# EAGLE design MAIN_TOP_P (EAGLE 9.4.2)
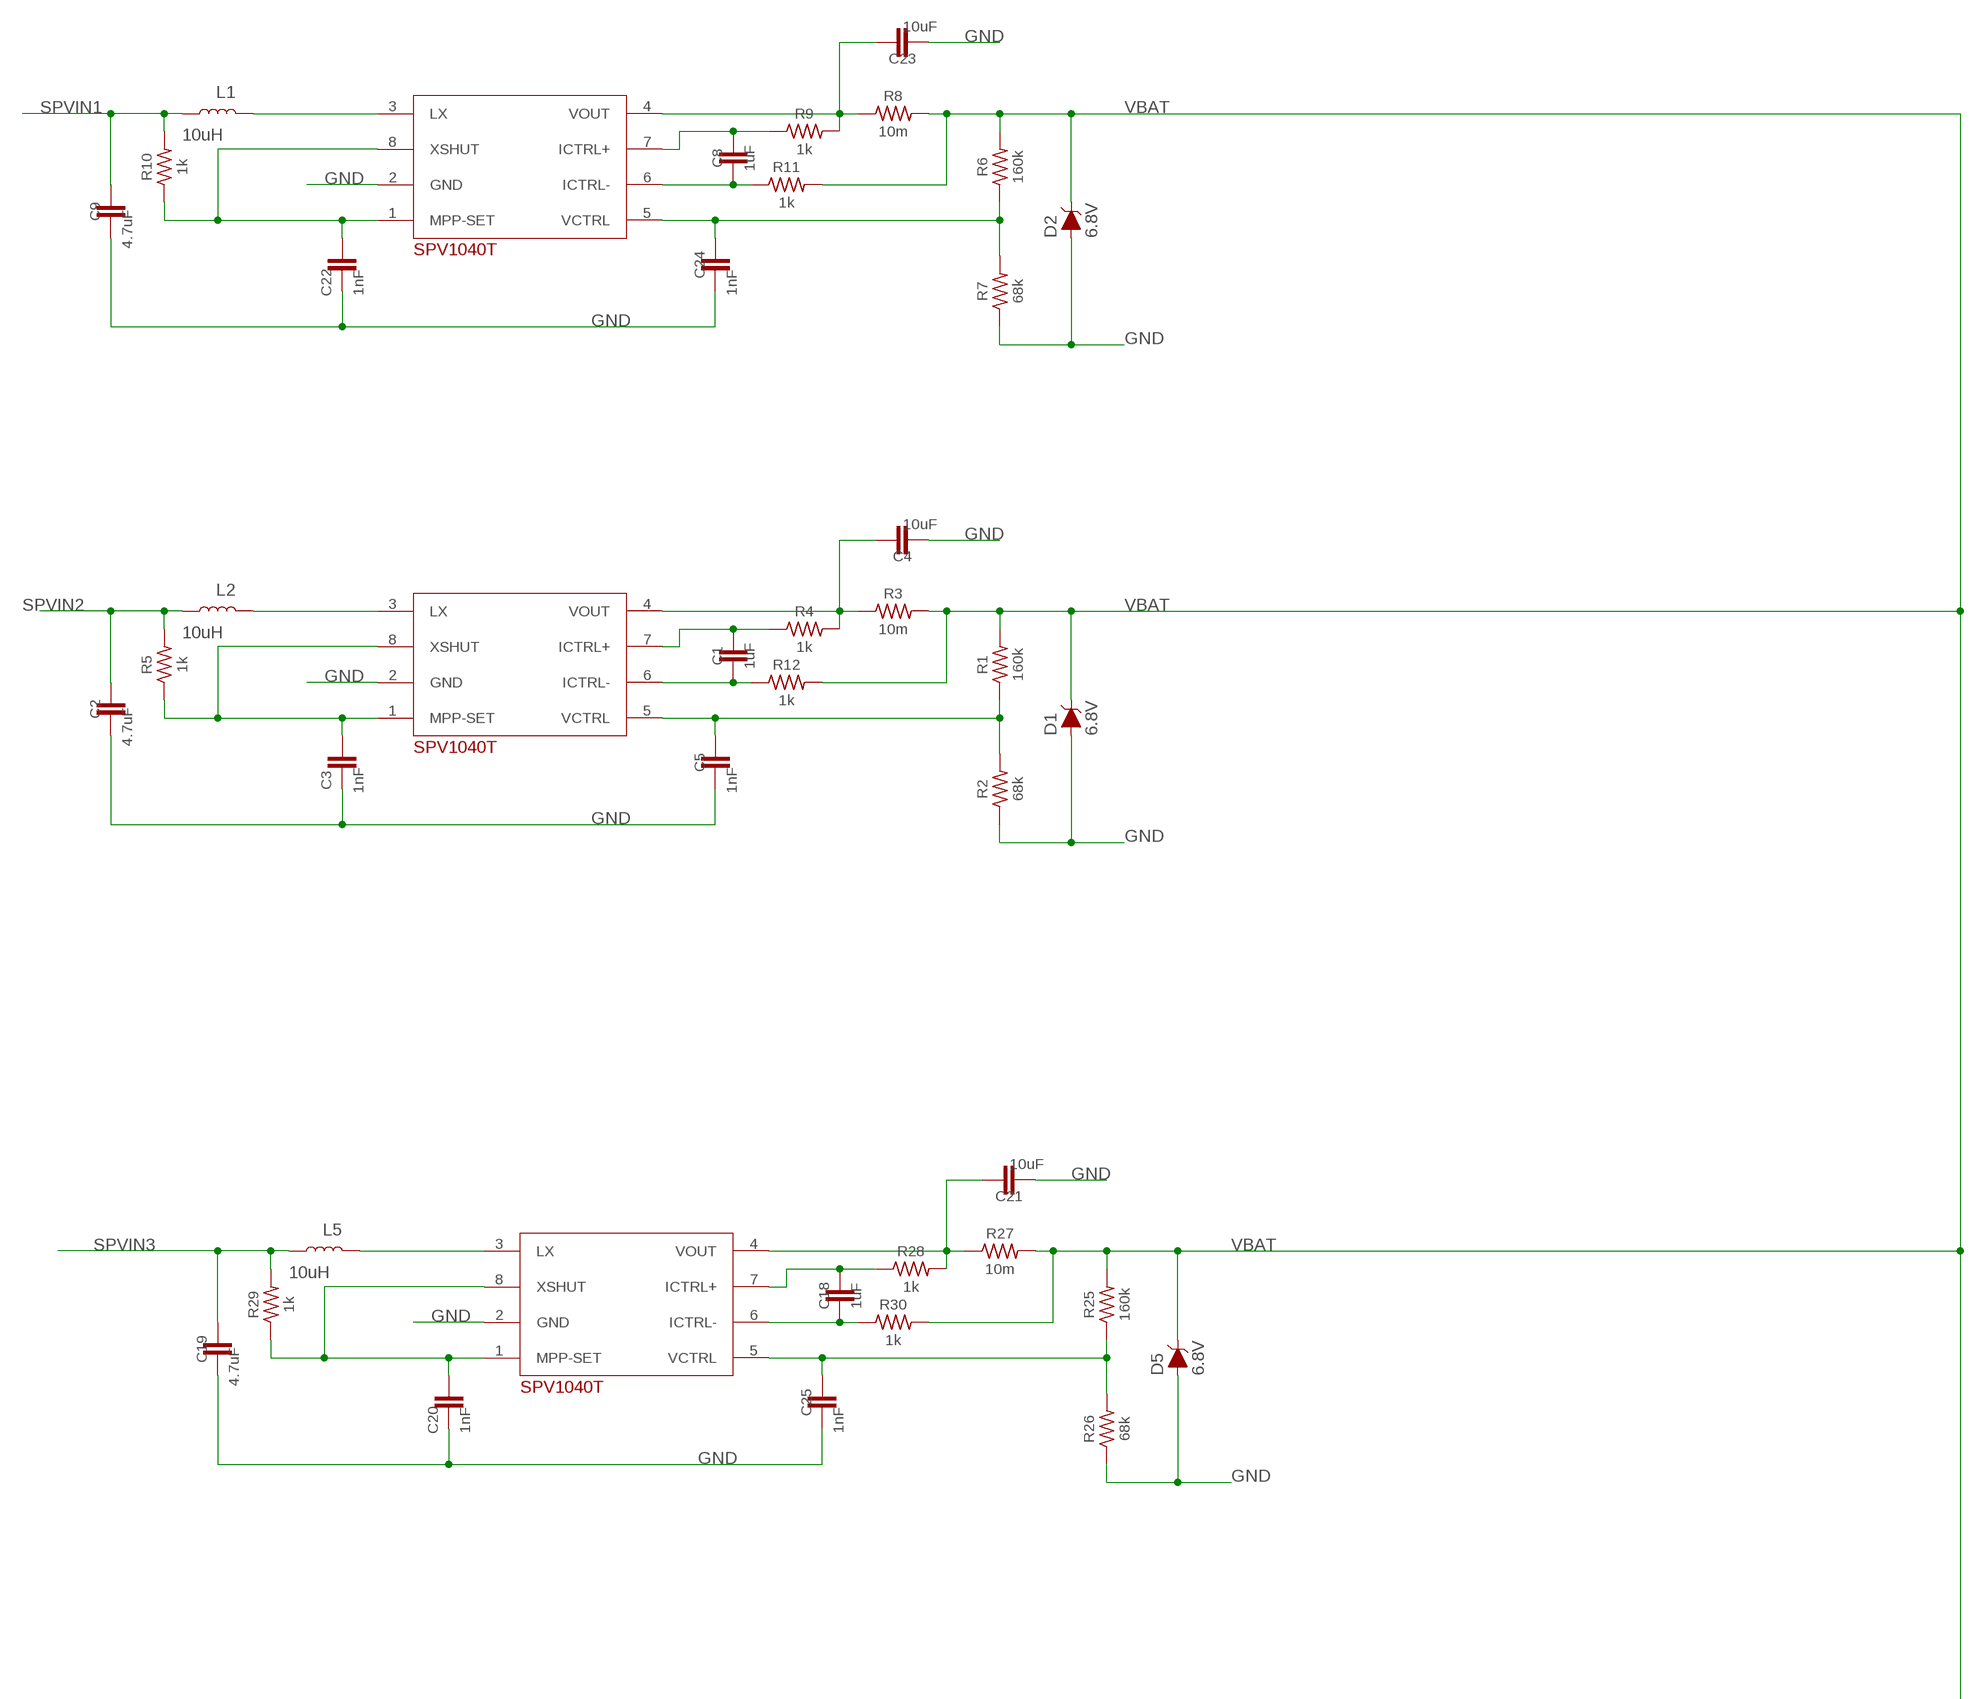
[diagram p0: schematic, sheet 1, part 1 of 3]
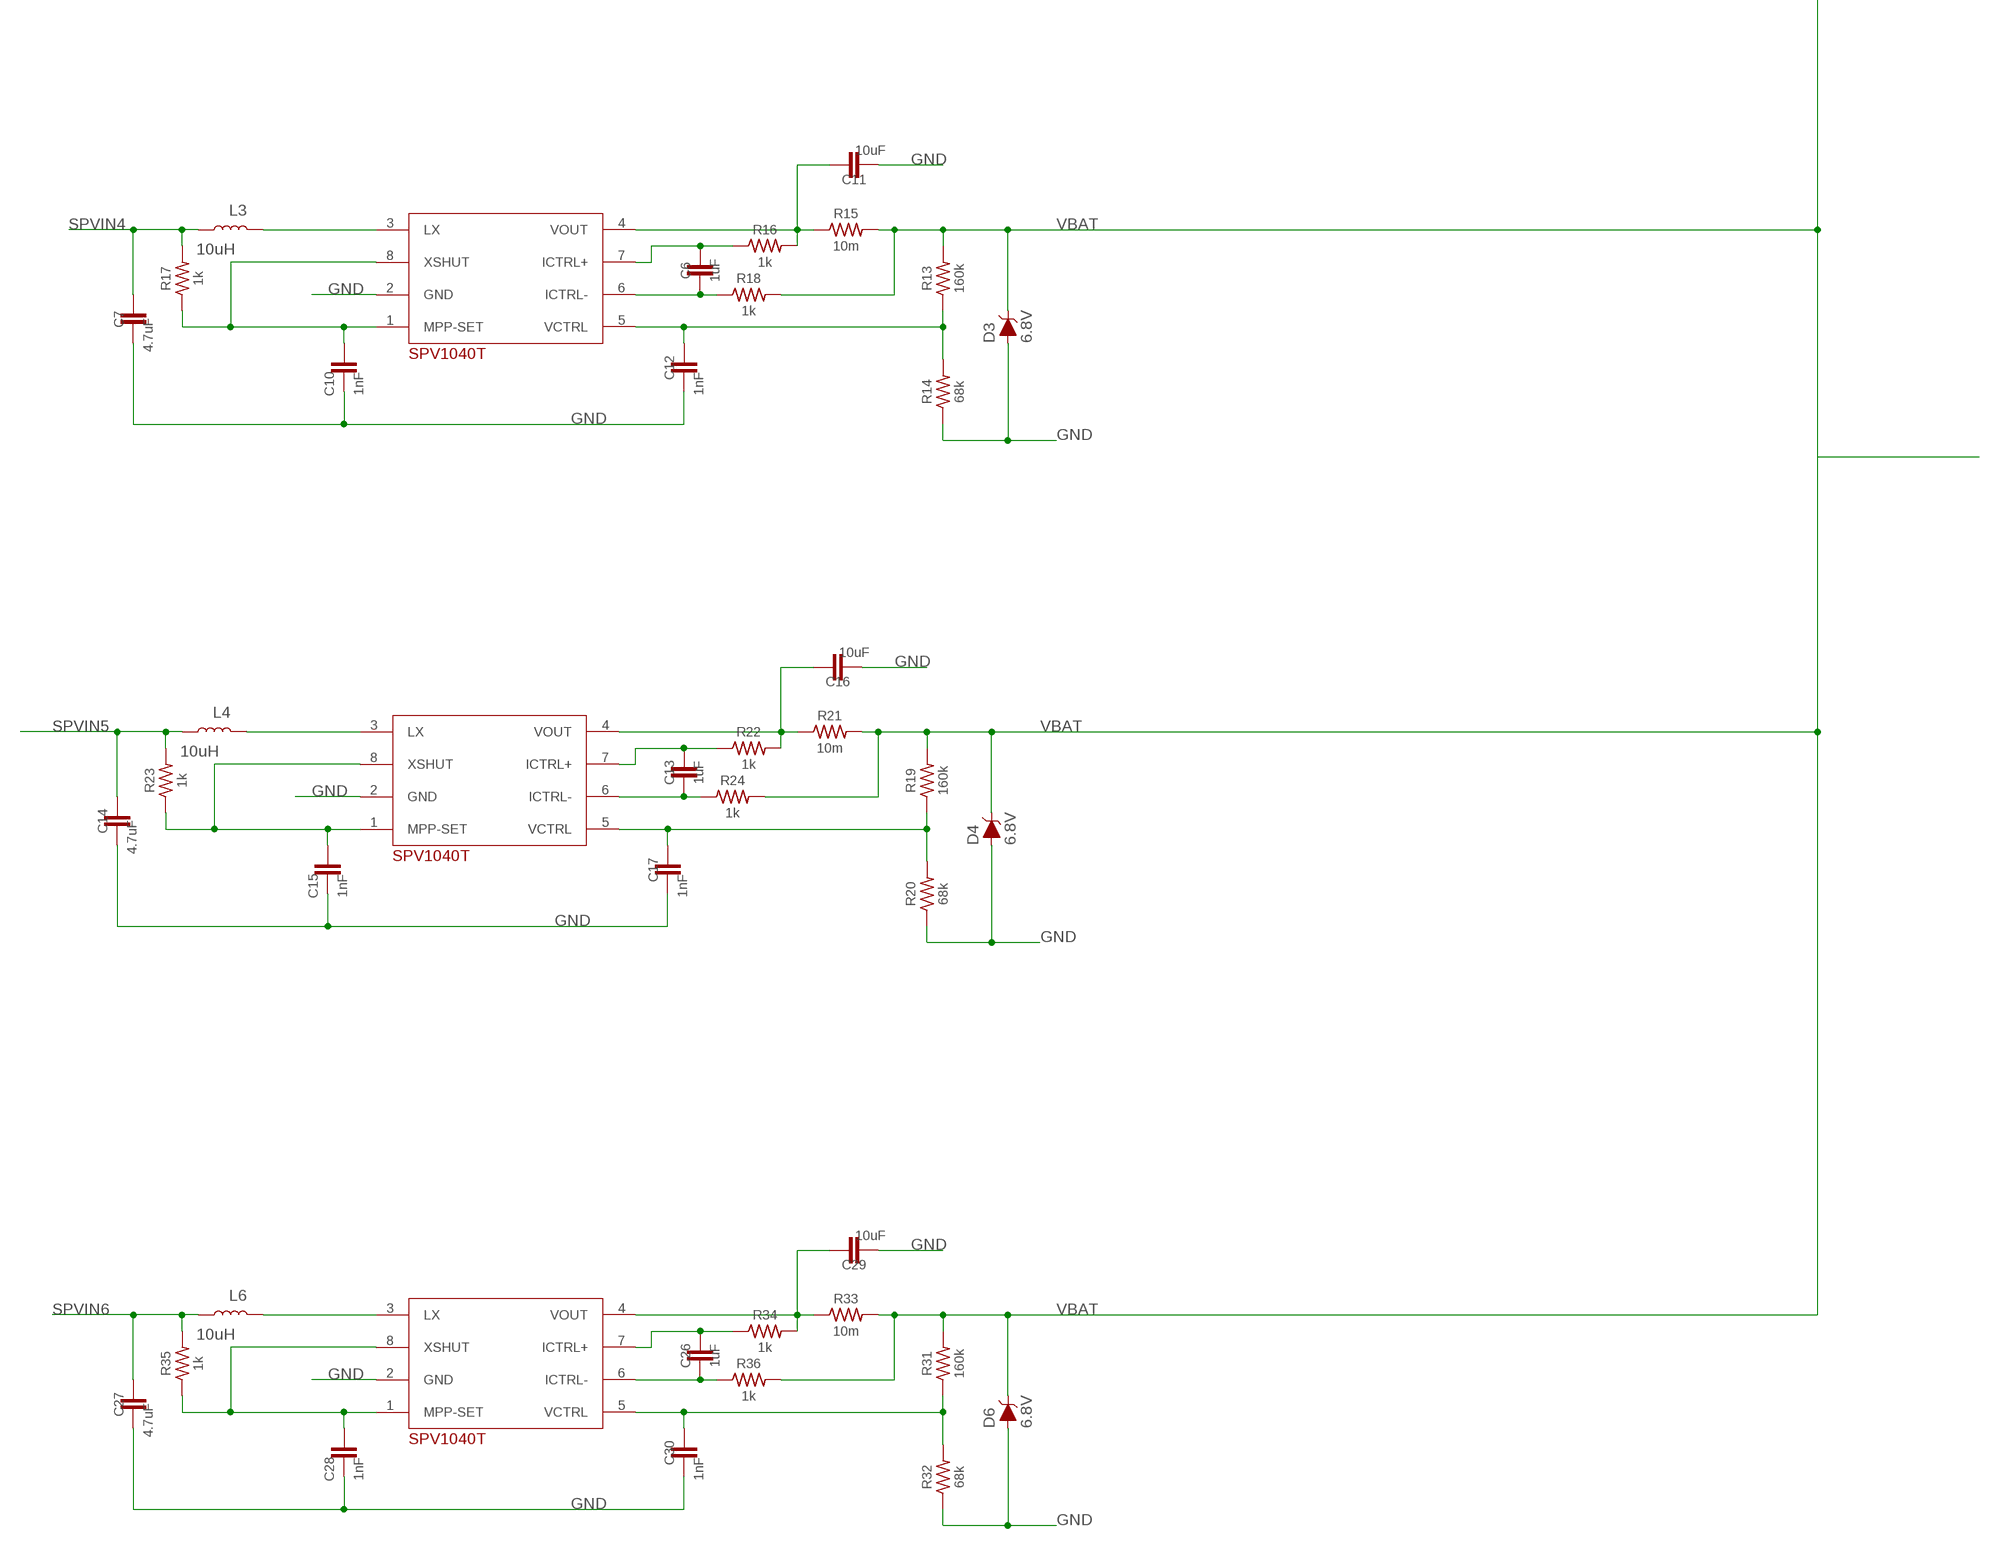
[diagram p1: schematic, sheet 1, part 2 of 3]
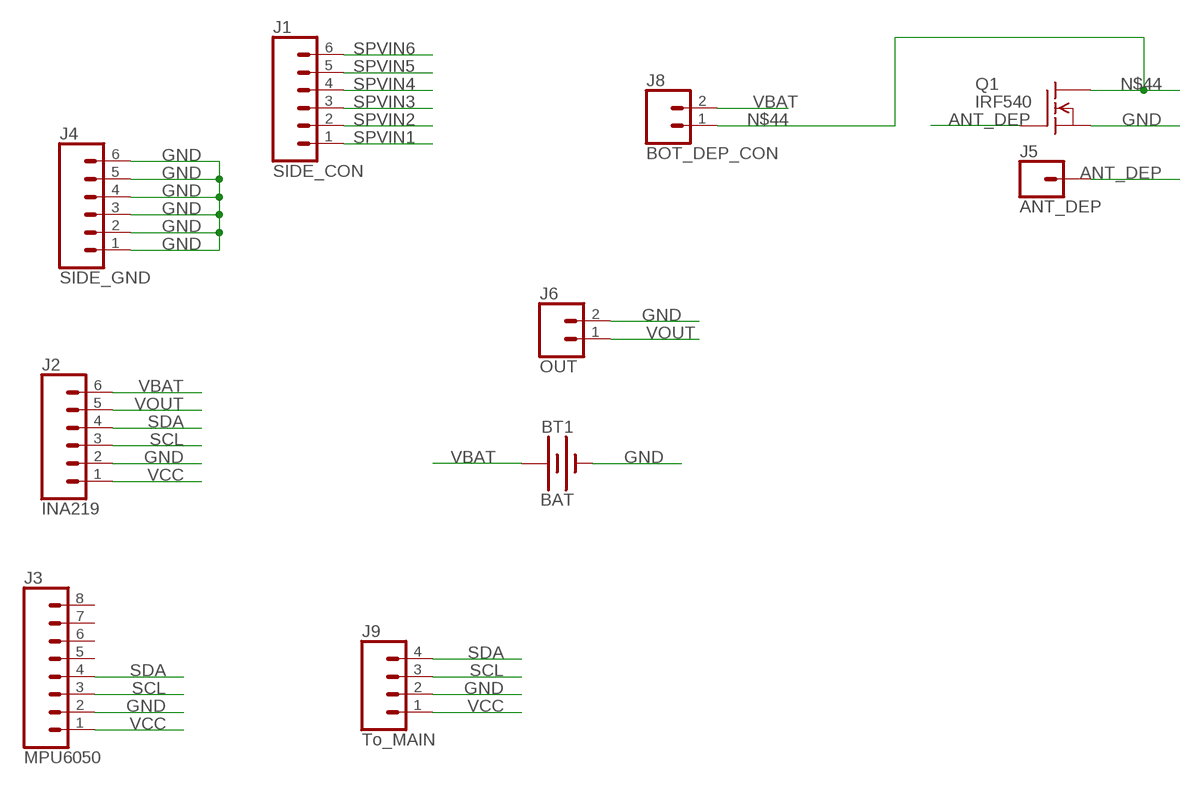
[diagram p2: schematic, sheet 1, part 3 of 3]

## Parts
BT1  BAT  BATTERY-18650  [BATTERY_18650-HOLDER]
C1  1uF  10UF-0603-6.3V-20%  [0603]
C2  4.7uF  10UF-0603-6.3V-20%  [0603]
C3  1nF  10UF-0603-6.3V-20%  [0603]
C4  10uF  10UF-0603-6.3V-20%  [0603]
C5  1nF  10UF-0603-6.3V-20%  [0603]
C6  1uF  10UF-0603-6.3V-20%  [0603]
C7  4.7uF  10UF-0603-6.3V-20%  [0603]
C8  1uF  10UF-0603-6.3V-20%  [0603]
C9  4.7uF  10UF-0603-6.3V-20%  [0603]
C10  1nF  10UF-0603-6.3V-20%  [0603]
C11  10uF  10UF-0603-6.3V-20%  [0603]
C12  1nF  10UF-0603-6.3V-20%  [0603]
C13  1uF  10UF-0603-6.3V-20%  [0603]
C14  4.7uF  10UF-0603-6.3V-20%  [0603]
C15  1nF  10UF-0603-6.3V-20%  [0603]
C16  10uF  10UF-0603-6.3V-20%  [0603]
C17  1nF  10UF-0603-6.3V-20%  [0603]
C18  1uF  10UF-0603-6.3V-20%  [0603]
C19  4.7uF  10UF-0603-6.3V-20%  [0603]
C20  1nF  10UF-0603-6.3V-20%  [0603]
C21  10uF  10UF-0603-6.3V-20%  [0603]
C22  1nF  10UF-0603-6.3V-20%  [0603]
C23  10uF  10UF-0603-6.3V-20%  [0603]
C24  1nF  10UF-0603-6.3V-20%  [0603]
C25  1nF  10UF-0603-6.3V-20%  [0603]
C26  1uF  10UF-0603-6.3V-20%  [0603]
C27  4.7uF  10UF-0603-6.3V-20%  [0603]
C28  1nF  10UF-0603-6.3V-20%  [0603]
C29  10uF  10UF-0603-6.3V-20%  [0603]
C30  1nF  10UF-0603-6.3V-20%  [0603]
D1  6.8V  DIODE-ZENER-MMSZ5232BS  [SOD-323]
D2  6.8V  DIODE-ZENER-MMSZ5232BS  [SOD-323]
D3  6.8V  DIODE-ZENER-MMSZ5232BS  [SOD-323]
D4  6.8V  DIODE-ZENER-MMSZ5232BS  [SOD-323]
D5  6.8V  DIODE-ZENER-MMSZ5232BS  [SOD-323]
D6  6.8V  DIODE-ZENER-MMSZ5232BS  [SOD-323]
J1  SIDE_CON  CONN_06SILK_FEMALE_PTH  [1X06]
J2  INA219  CONN_06SILK_FEMALE_PTH  [1X06]
J3  MPU6050  CONN_08"  [1X08]
J4  SIDE_GND  CONN_06SILK_FEMALE_PTH  [1X06]
J5  ANT_DEP  CONN_01  [1X01]
J6  OUT  CONN_02  [1X02]
J8  BOT_DEP_CON  CONN_02  [1X02]
J9  To_MAIN  CONN_04PTH  [1X04]
L1  10uH  INDUCTOR-0603-33NH  [0603]
L2  10uH  INDUCTOR-0603-33NH  [0603]
L3  10uH  INDUCTOR-0603-33NH  [0603]
L4  10uH  INDUCTOR-0603-33NH  [0603]
L5  10uH  INDUCTOR-0603-33NH  [0603]
L6  10uH  INDUCTOR-0603-33NH  [0603]
Q1  IRF540  [TO220]
R1  160k  RC0603JR-070RL  [RES_0603]
R2  68k  RC0603JR-070RL  [RES_0603]
R3  10m  RC0603JR-070RL  [RES_0603]
R4  1k  RC0603JR-070RL  [RES_0603]
R5  1k  RC0603JR-070RL  [RES_0603]
R6  160k  RC0603JR-070RL  [RES_0603]
R7  68k  RC0603JR-070RL  [RES_0603]
R8  10m  RC0603JR-070RL  [RES_0603]
R9  1k  RC0603JR-070RL  [RES_0603]
R10  1k  RC0603JR-070RL  [RES_0603]
R11  1k  RC0603JR-070RL  [RES_0603]
R12  1k  RC0603JR-070RL  [RES_0603]
R13  160k  RC0603JR-070RL  [RES_0603]
R14  68k  RC0603JR-070RL  [RES_0603]
R15  10m  RC0603JR-070RL  [RES_0603]
R16  1k  RC0603JR-070RL  [RES_0603]
R17  1k  RC0603JR-070RL  [RES_0603]
R18  1k  RC0603JR-070RL  [RES_0603]
R19  160k  RC0603JR-070RL  [RES_0603]
R20  68k  RC0603JR-070RL  [RES_0603]
R21  10m  RC0603JR-070RL  [RES_0603]
R22  1k  RC0603JR-070RL  [RES_0603]
R23  1k  RC0603JR-070RL  [RES_0603]
R24  1k  RC0603JR-070RL  [RES_0603]
R25  160k  RC0603JR-070RL  [RES_0603]
R26  68k  RC0603JR-070RL  [RES_0603]
R27  10m  RC0603JR-070RL  [RES_0603]
R28  1k  RC0603JR-070RL  [RES_0603]
R29  1k  RC0603JR-070RL  [RES_0603]
R30  1k  RC0603JR-070RL  [RES_0603]
R31  160k  RC0603JR-070RL  [RES_0603]
R32  68k  RC0603JR-070RL  [RES_0603]
R33  10m  RC0603JR-070RL  [RES_0603]
R34  1k  RC0603JR-070RL  [RES_0603]
R35  1k  RC0603JR-070RL  [RES_0603]
R36  1k  RC0603JR-070RL  [RES_0603]
SPV_1  SPV1040T_  [SOP65P640X120-8N]
SPV_2  SPV1040T_  [SOP65P640X120-8N]
SPV_3  SPV1040T_  [SOP65P640X120-8N]
SPV_4  SPV1040T_  [SOP65P640X120-8N]
SPV_5  SPV1040T_  [SOP65P640X120-8N]
SPV_6  SPV1040T_  [SOP65P640X120-8N]

## Nets
ANT_DEP: J5.1 Q1.1(G)
GND [vcc]: BT1.GND@1(-) C2.2 C3.2 C4.2 C5.2 C7.2 C9.2 C10.2 C11.2 C12.2 C14.2 C15.2 C16.2 C17.2 C19.2 C20.2 C21.2 C22.2 C23.2 C24.2 C25.2 C27.2 C28.2 C29.2 C30.2 D1.A D2.A D3.A D4.A D5.A D6.A J2.2 J3.2 J4.1 J4.2 J4.3 J4.4 J4.5 J4.6 J6.2 J9.2 Q1.3(S) R2.1 R7.1 R14.1 R20.1 R26.1 R32.1 SPV_1.2(GND) SPV_2.2(GND) SPV_3.2(GND) SPV_4.2(GND) SPV_5.2(GND) SPV_6.2(GND)
N$1: L2.2 SPV_2.3(LX)
N$2: C3.1 R5.1 SPV_2.1(MPP-SET) SPV_2.8(XSHUT)
N$3: C5.1 R1.1 R2.2 SPV_2.5(VCTRL)
N$4: C1.2 R12.1 SPV_2.6(ICTRL-)
N$5: L1.2 SPV_1.3(LX)
N$6: C1.1 R4.1 SPV_2.7(ICTRL+)
N$7: C4.1 R3.1 R4.2 SPV_2.4(VOUT)
N$8: L3.2 SPV_4.3(LX)
N$9: C10.1 R17.1 SPV_4.1(MPP-SET) SPV_4.8(XSHUT)
N$10: C12.1 R13.1 R14.2 SPV_4.5(VCTRL)
N$11: C6.2 R18.1 SPV_4.6(ICTRL-)
N$12: C6.1 R16.1 SPV_4.7(ICTRL+)
N$13: C11.1 R15.1 R16.2 SPV_4.4(VOUT)
N$14: L4.2 SPV_5.3(LX)
N$15: C15.1 R23.1 SPV_5.1(MPP-SET) SPV_5.8(XSHUT)
N$16: C17.1 R19.1 R20.2 SPV_5.5(VCTRL)
N$17: C13.2 R24.1 SPV_5.6(ICTRL-)
N$18: C13.1 R22.1 SPV_5.7(ICTRL+)
N$19: C16.1 R21.1 R22.2 SPV_5.4(VOUT)
N$20: L5.2 SPV_3.3(LX)
N$21: C20.1 R29.1 SPV_3.1(MPP-SET) SPV_3.8(XSHUT)
N$22: C25.1 R25.1 R26.2 SPV_3.5(VCTRL)
N$23: C18.2 R30.1 SPV_3.6(ICTRL-)
N$24: C18.1 R28.1 SPV_3.7(ICTRL+)
N$25: C21.1 R27.1 R28.2 SPV_3.4(VOUT)
N$26: L6.2 SPV_6.3(LX)
N$27: C28.1 R35.1 SPV_6.1(MPP-SET) SPV_6.8(XSHUT)
N$28: C30.1 R31.1 R32.2 SPV_6.5(VCTRL)
N$29: C26.2 R36.1 SPV_6.6(ICTRL-)
N$30: C26.1 R34.1 SPV_6.7(ICTRL+)
N$31: C22.1 R10.1 SPV_1.1(MPP-SET) SPV_1.8(XSHUT)
N$32: C24.1 R6.1 R7.2 SPV_1.5(VCTRL)
N$33: C29.1 R33.1 R34.2 SPV_6.4(VOUT)
N$34: C8.2 R11.1 SPV_1.6(ICTRL-)
N$35: C8.1 R9.1 SPV_1.7(ICTRL+)
N$36: C23.1 R8.1 R9.2 SPV_1.4(VOUT)
N$44: J8.1 Q1.2(D)
SCL: J2.3 J3.3 J9.3
SDA: J2.4 J3.4 J9.4
SPVIN1: C9.1 J1.1 L1.1 R10.2
SPVIN2: C2.1 J1.2 L2.1 R5.2
SPVIN3: C19.1 J1.3 L5.1 R29.2
SPVIN4: C7.1 J1.4 L3.1 R17.2
SPVIN5: C14.1 J1.5 L4.1 R23.2
SPVIN6: C27.1 J1.6 L6.1 R35.2
VBAT: BT1.PWR@1(+) D1.C D2.C D3.C D4.C D5.C D6.C J2.6 J8.2 R1.2 R3.2 R6.2 R8.2 R11.2 R12.2 R13.2 R15.2 R18.2 R19.2 R21.2 R24.2 R25.2 R27.2 R30.2 R31.2 R33.2 R36.2
VCC: J2.1 J3.1 J9.1
VOUT: J2.5 J6.1
Unconnected: J3.5 J3.6 J3.7 J3.8

## Library data of the parts
BT1 = SparkFun-Batteries:BATTERY: Battery - Single Cell A variety of battery chemistries, sizes, and footprints. Device List: 20MM_PTH - Coin Cell Battery Holder - 20mm (PTH) <https://www.sparkfun.com/products/783> 20MM_PTH_KIT- Coin Cell battery Holder - 20 mm (PTH) <http://www.sparkfun.com/products/783>kit version with special mask 6.8MM_PTH - Coin Cell Battery Holder - 6.8MM(SMD) <https://www.digikey.com/product-detail/en/seiko-instruments/MS621FE-FL11E/728-1057-ND/1889208?WT.srch=1&gclid=CNOQ5a6LzdQCFZS2wAodXCkE0g> 12MM_SMD - Coin Cell Battery Holder - 12mm (SMD) <https://www.sparkfun.com/products/10592> 12MM_PTH - Coin Cell Battery Holder - 12mm (PTH) <https://www.sparkfun.com/products/7948> 20MM_SMD - 20mm Coin Cell Battery Holder (SMD) (2 legs) Used on the Big Time Watch Kit <https://www.sparkfun.com/products/11734> 20MM_SMD_4LEGS - Coin Cell Battery Holder - 20mm (SMD) <https://www.sparkfun.com/products/11892> 20MM_SMD_4LEGS_OVERPASTE - Coin Cell Battery Holder - 20mm (SMD) <https://www.sparkfun.com/products/11892> (Over-paste on the legs) 24.5MM_PTH - Coin Cell Battery Holder - 24.5mm (PTH) <https://www.sparkfun.com/products/8863> 9V - 9V Battery Holder - PC Mount Used on the SparkFun SparkPunk Sound Kit <https://www.sparkfun.com/products/11177> and SparkFun SparkPunk Sequencer Kit <https://www.sparkfun.com/products/12707> 18650 - Battery Holder - 18650 (PTH) <https://www.sparkfun.com/products/13113> AA - Battery Holder - 1xAA (PTH) <https://www.sparkfun.com/products/7949> AAA - Battery Holder - 1xAAA (PTH) <https://www.sparkfun.com/products/12718> AA_KIT - Battery Holder - 1xAA (PTH) <https://www.sparkfun.com/products/7949> Special kit package - pads only have exposed copper on one side of the board. AAA_KIT - Battery Holder - 1xAAA (PTH) <https://www.sparkfun.com/products/12718> Special kit package - pads only have exposed copper on one side of the board.; PROD_ID: BATT-12327; SF_SKU: PRT-13113
C1-C3 C5-C10 C12-C15 C17-C20 C22 C24-C28 C30 = SparkFun-Capacitors:10UF: 10.0µF ceramic capacitors A capacitor is a passive two-terminal electrical component used to store electrical energy temporarily in an electric field.; PROD_ID: CAP-11015; VALUE: 10uF
C4 C11 C16 C21 C23 C29 = SparkFun-Capacitors:10UF: 10.0µF ceramic capacitors A capacitor is a passive two-terminal electrical component used to store electrical energy temporarily in an electric field.; PROD_ID: CAP-11015
D1-D6 = SparkFun-DiscreteSemi:DIODE-ZENER: Zener Diode A Zener diode allows current to flow from its anode to its cathode like a normal semiconductor diode, but it also permits current to flow in the reverse direction when its "Zener voltage" is reached. - WIkipedia; PROD_ID: DIO-12442; VALUE: 5.6V
J1 J2 J4 = SparkFun-Connectors:CONN_06: Multi connection point. Often used as Generic Header-pin footprint for 0.1 inch spaced/style header connections On any of the 0.1 inch spaced packages, you can populate with these: Break Away Headers - Straight <https://www.sparkfun.com/products/116> (PRT-00116) Break Away Male Headers - Right Angle <https://www.sparkfun.com/products/553> (PRT-00553) Female Headers <https://www.sparkfun.com/products/115> (PRT-00115) Break Away Headers - Machine Pin <https://www.sparkfun.com/products/117> (PRT-00117) Break Away Female Headers - Swiss Machine Pin <https://www.sparkfun.com/products/743> (PRT-00743) Arduino Stackable Header - 6 Pin <https://www.sparkfun.com/products/9280> (PRT-09280) For SCREWTERMINALS and SPRING TERMINALS visit here: Screw Terimnals on SparkFun.com <https://www.sparkfun.com/search/results?term=Screw+Terminals> (5mm/3.5mm/2.54mm spacing) This device is also useful as a general connection point to wire up your design to another part of your project. Our various solder wires solder well into these plated through hole pads. Hook-Up Wire - Assortment (Stranded, 22 AWG) <https://www.sparkfun.com/products/11375> (PRT-11375) Hook-Up Wire - Assortment (Solid Core, 22 AWG) <https://www.sparkfun.com/products/11367> (PRT-11367) View the entire wire category on our website here <https://www.sparkfun.com/categories/141>; PROD_ID: CONN-08437
J3 = SparkFun-Connectors:CONN_08: Multi connection point. Often used as Generic Header-pin footprint for 0.1 inch spaced/style header connections On any of the 0.1 inch spaced packages, you can populate with these: Break Away Headers - Straight <https://www.sparkfun.com/products/116> (PRT-00116) Break Away Male Headers - Right Angle <https://www.sparkfun.com/products/553> (PRT-00553) Female Headers <https://www.sparkfun.com/products/115> (PRT-00115) Break Away Headers - Machine Pin <https://www.sparkfun.com/products/117> (PRT-00117) Break Away Female Headers - Swiss Machine Pin <https://www.sparkfun.com/products/743> (PRT-00743) Arduino Stackable Header - 8 Pin <https://www.sparkfun.com/products/9279> (PRT-09279) For SCREWTERMINALS and SPRING TERMINALS visit here: Screw Terimnals on SparkFun.com <https://www.sparkfun.com/search/results?term=Screw+Terminals> (5mm/3.5mm/2.54mm spacing) This device is also useful as a general connection point to wire up your design to another part of your project. Our various solder wires solder well into these plated through hole pads. Hook-Up Wire - Assortment (Stranded, 22 AWG) <https://www.sparkfun.com/products/11375> (PRT-11375) Hook-Up Wire - Assortment (Solid Core, 22 AWG) <https://www.sparkfun.com/products/11367> (PRT-11367) View the entire wire category on our website here <https://www.sparkfun.com/categories/141> Special notes: Molex polarized connector foot print use with SKU : PRT-08231 with associated crimp pins and housings. 1MM SMD Version SKU: PRT-10208 NOTES ON THE VARIANTS LOCK and LOCK_LONGPADS... This footprint was designed to help hold the alignment of a through-hole component (i.e. 6-pin header) while soldering it into place. You may notice that each hole has been shifted either up or down by 0.005 of an inch from it's more standard position (which is a perfectly straight line). This slight alteration caused the pins (the squares in the middle) to touch the edges of the holes. Because they are alternating, it causes a "brace" to hold the component in place. 0.005 has proven to be the perfect amount of "off-center" position when using our standard breakaway headers. Although looks a little odd when you look at the bare footprint, once you have a header in there, the alteration is very hard to notice. Also,if you push a header all the way into place, it is covered up entirely on the bottom side.; PROD_ID: CONN-08438
J5 = SparkFun-Connectors:CONN_01: Single connection point. Often used as Generic Header-pin footprint for 0.1 inch spaced/style header connections On any of the 0.1 inch spaced packages, you can populate with these: Break Away Headers - Straight <https://www.sparkfun.com/products/116> (PRT-00116) Break Away Male Headers - Right Angle <https://www.sparkfun.com/products/553> (PRT-00553) Female Headers <https://www.sparkfun.com/products/115> (PRT-00115) Break Away Headers - Machine Pin <https://www.sparkfun.com/products/117> (PRT-00117) Break Away Female Headers - Swiss Machine Pin <https://www.sparkfun.com/products/743> (PRT-00743) This device is also useful as a general connection point to wire up your design to another part of your project. Our various solder wires solder well into these plated through hole pads. Hook-Up Wire - Assortment (Stranded, 22 AWG) <https://www.sparkfun.com/products/11375> (PRT-11375) Hook-Up Wire - Assortment (Solid Core, 22 AWG) <https://www.sparkfun.com/products/11367> (PRT-11367) View the entire wire category on our website here <https://www.sparkfun.com/categories/141> Special notes: SMTSO-256-ET is a "flush mount" nut for a 4-40 screw. We mostly use this on specialty testbeds; it is a nice way to connect hardware to your PCB at an adjustable hieght. Also note, the SNAP packages are for using a snappable style connector. We sell a baggie of snaps and they are also used on two LilyPad designs: Snap Assortment - 30 pack (male and female) <https://www.sparkfun.com/products/11347> (DEV-11347) LilyPad Arduino SimpleSnap <https://www.sparkfun.com/products/10941> (DEV-10941) LilyPad SimpleSnap Protoboard <https://www.sparkfun.com/products/10940> (DEV-10940)
J6 J8 = SparkFun-Connectors:CONN_02: Multi connection point. Often used as Generic Header-pin footprint for 0.1 inch spaced/style header connections On any of the 0.1 inch spaced packages, you can populate with these: Break Away Headers - Straight <https://www.sparkfun.com/products/116> (PRT-00116) Break Away Male Headers - Right Angle <https://www.sparkfun.com/products/553> (PRT-00553) Female Headers <https://www.sparkfun.com/products/115> (PRT-00115) Break Away Headers - Machine Pin <https://www.sparkfun.com/products/117> (PRT-00117) Break Away Female Headers - Swiss Machine Pin <https://www.sparkfun.com/products/743> (PRT-00743) For SCREWTERMINALS and SPRING TERMINALS visit here: Screw Terimnals on SparkFun.com <https://www.sparkfun.com/search/results?term=Screw+Terminals> (5mm/3.5mm/2.54mm spacing) This device is also useful as a general connection point to wire up your design to another part of your project. Our various solder wires solder well into these plated through hole pads. Hook-Up Wire - Assortment (Stranded, 22 AWG) <https://www.sparkfun.com/products/11375> (PRT-11375) Hook-Up Wire - Assortment (Solid Core, 22 AWG) <https://www.sparkfun.com/products/11367> (PRT-11367) View the entire wire category on our website here <https://www.sparkfun.com/categories/141> Special notes: Molex polarized connector foot print use with: PRT-08233 with associated crimp pins and housings. 2.54_SCREWTERM for use with PRT-10571. 3.5mm Screw Terminal footprints for PRT-08084 5mm Screw Terminal footprints for use with PRT-08432
J9 = SparkFun-Connectors:CONN_04: Multi connection point. Often used as Generic Header-pin footprint for 0.1 inch spaced/style header connections On any of the 0.1 inch spaced packages, you can populate with these: Break Away Headers - Straight <https://www.sparkfun.com/products/116> (PRT-00116) Break Away Male Headers - Right Angle <https://www.sparkfun.com/products/553> (PRT-00553) Female Headers <https://www.sparkfun.com/products/115> (PRT-00115) Break Away Headers - Machine Pin <https://www.sparkfun.com/products/117> (PRT-00117) Break Away Female Headers - Swiss Machine Pin <https://www.sparkfun.com/products/743> (PRT-00743) For SCREWTERMINALS and SPRING TERMINALS visit here: Screw Terimnals on SparkFun.com <https://www.sparkfun.com/search/results?term=Screw+Terminals> (5mm/3.5mm/2.54mm spacing) This device is also useful as a general connection point to wire up your design to another part of your project. Our various solder wires solder well into these plated through hole pads. Hook-Up Wire - Assortment (Stranded, 22 AWG) <https://www.sparkfun.com/products/11375> (PRT-11375) Hook-Up Wire - Assortment (Solid Core, 22 AWG) <https://www.sparkfun.com/products/11367> (PRT-11367) View the entire wire category on our website here <https://www.sparkfun.com/categories/141> Special notes: Molex polarized connector foot print use with SKU : PRT-08231 with associated crimp pins and housings. 1MM SMD Version SKU: PRT-10208; PROD_ID: CONN-09696
L1-L6 = SparkFun-Coils:INDUCTOR: Inductors Resist changes in electrical current. Basically a coil of wire. SparkFun Products: SparkFun Load Cell Amplifier - HX711 <https://www.sparkfun.com/products/13879> IOIO-OTG - V2.2 <https://www.sparkfun.com/products/13613>; PROD_ID: NDUC-07874; VALUE: 33nH/±5%/500mA
Q1 = transistor-fet:IRF540: N-Channel Enhancement MOSFET (HEXFET); 100V; 28A; 0,077Ohm
R1-R36 = Resistor_Capacitor:RC0603JR-070RL: RES SMD 0 OHM JUMPER 1/10W 0603 Manufacturer's datasheet <http://www.yageo.com/documents/recent/PYu-RC_Group_51_RoHS_L_10.pdf>; CREATED_BY: PCBLayout.com; DIGIKEY_PART_NUMBER: 311-0.0GRTR-ND; MANUFACTURER: Yageo; MPN: RC0603JR-070RL; PACKAGE: SMD 0603
SPV_1-SPV_6 = SPV1040T:SPV1040T_

## Net classes
1 vcc: width 0.254 mm

## Board
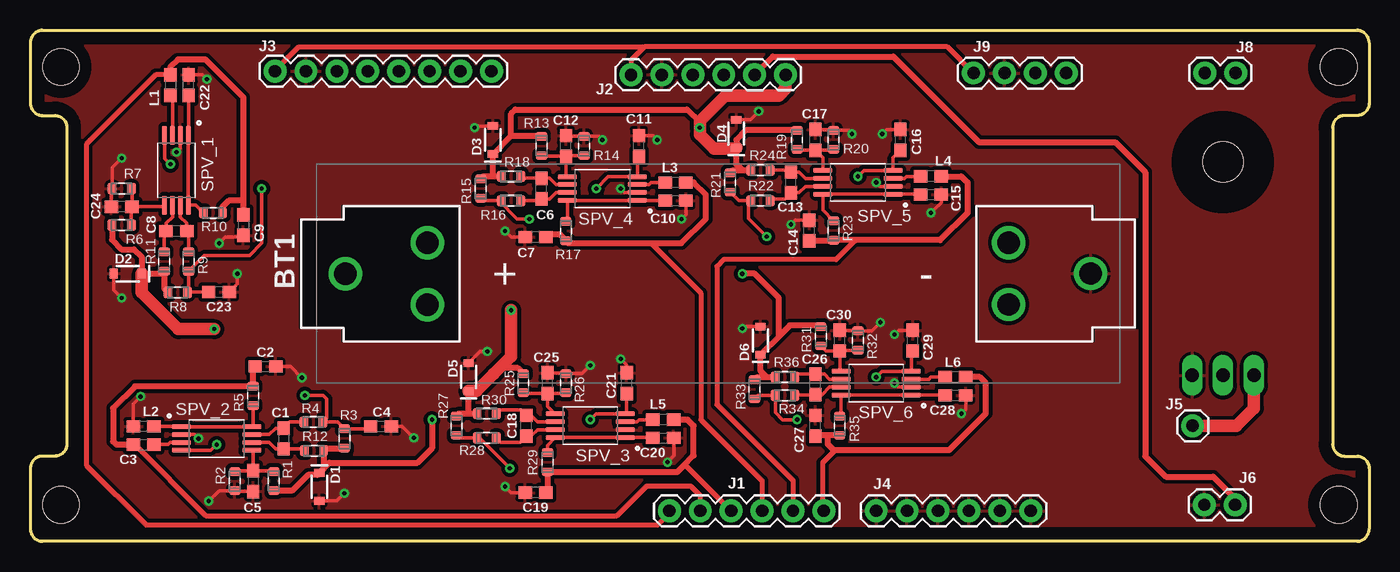
[diagram p3: board, top side]
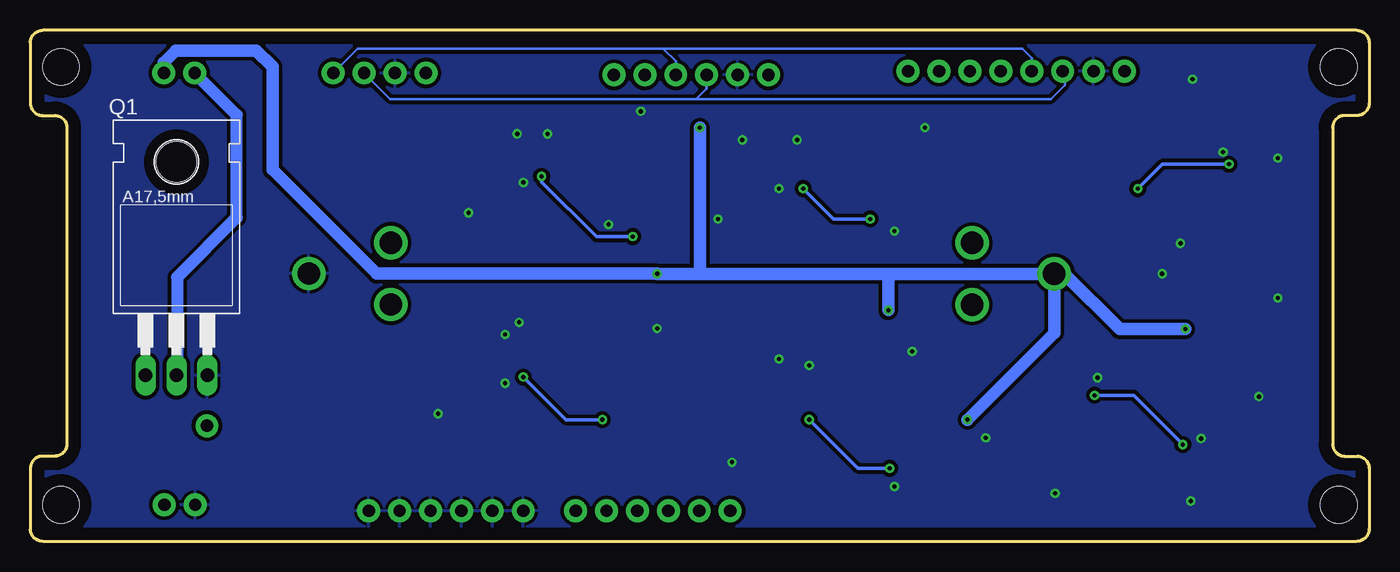
[diagram p4: board, bottom side, seen from below]

Size 110 x 42 mm. Coordinates in mm from the lower left corner, seen from the top.
Outline: 109,0 arc90 110,1 110,6 arc90 109,7 108,7 arc-90 107,8 107,34 arc-90 108,35 109,35 arc90 110,36 110,41 arc90 109,42 1,42 arc90 0,41 0,36 arc90 1,35 2,35 arc-90 3,34 3,8 arc-90 2,7 1,7 arc90 0,6 0,1 arc90 1,0 109,0
Copper layers (1*16): Top 0.035mm / dielectric 0.2mm / Bottom 0.035mm
Design rules "default *": minimum track width 6mil, minimum drill 0.35mm, track to track 12mil, track to pad 6mil, pad to pad 6mil, via to via 6mil, smd to smd 6mil, copper to edge 40mil, drill to drill 6mil, minimum pad ring 10mil, minimum via ring 8mil, stop-mask expansion 4mil, vias tented up to drill 0mil, thermal gap 10mil
Holes 3 mm at 2.5,39 2.5,3 107.5,3 107.5,39

### Footprints (pad centres in the part's own frame; a part is rotated, then mirrored left to right if it is on the bottom)
BATTERY_18650-HOLDER = drill 1.829: GND@1 30.628,0.01; GND@2 23.88,2.55; GND@3 23.88,-2.53; PWR@1 -30.628,-0.01; PWR@2 -23.88,2.53; PWR@3 -23.88,-2.55
0603 = smd 1.1 x 1: 1 -0.85,0; 2 0.85,0
SOD-323 = smd 0.63 x 0.83: A 1.15,0; C -1.15,0
1X06 = drill 1.016 pad 1.88: 1 0,0; 2 2.54,0; 3 5.08,0; 4 7.62,0; 5 10.16,0; 6 12.7,0
1X08 = drill 1.016 pad 1.88: 1 0,0; 2 2.54,0; 3 5.08,0; 4 7.62,0; 5 10.16,0; 6 12.7,0; 7 15.24,0; 8 17.78,0
1X01 = drill 1.016 pad 1.88: 1 0,0
1X02 = drill 1.016 pad 1.88: 1 0,0; 2 2.54,0
1X04 = drill 1.016 pad 1.88: 1 0,0; 2 2.54,0; 3 5.08,0; 4 7.62,0
TO220 = drill 1.118 long: 1 -2.54,-6.35; 2 0,-6.35; 3 2.54,-6.35 | hole 3.302: 0,11.176
RES_0603 = smd 0.74 x 0.93: 1 -0.795,0; 2 0.795,0
SOP65P640X120-8N = smd 1.56 x 0.41: 1 -2.88,0.975; 2 -2.88,0.325; 3 -2.88,-0.325; 4 -2.88,-0.975; 5 2.88,-0.975; 6 2.88,-0.325; 7 2.88,0.325; 8 2.88,0.975

### Placement (x,y rotation side)
BT1  56.5,22 0 top
C1  20.8,8.45 270 top
C2  19.31,14.37 0 top
C3  9.3,9.45 180 top
C4  28.8,9.45 0 top
C5  18.3,4.95 270 top
C6  42,29 90 top
C7  41.5,25 180 top
C8  12,25.5 180 top
C9  17.5,26 270 top
C10  53,28 0 top
C11  50,32.5 90 top
C12  44,32.5 90 top
C13  62.5,29.5 90 top
C14  64,25.55 90 top
C15  74,28.5 0 top
C16  71.5,33 90 top
C17  64.5,33 90 top
C18  40.75,9.5 90 top
C19  41.5,4 180 top
C20  52,8.5 0 top
C21  49,13 90 top
C22  13,37.5 90 top
C23  15.5,20.5 0 top
C24  7.5,27.5 180 top
C25  42.5,13 90 top
C26  64.5,12.9 90 top
C27  64.5,9.5 90 top
C28  76,12 0 top
C29  72.5,16.5 90 top
C30  66.5,16.5 90 top
D1  23.74,4.47 270 top
D2  8,22 180 top
D3  38,33 90 top
D4  58,33.5 90 top
D5  36,13.5 90 top
D6  60,16.5 90 top
J1  52.5,2.5 0 top
J2  49.35,38.35 0 top
J3  20.1,38.65 0 top
J4  69.5,2.5 0 top
J5  95.5,9.5 0 top
J6  99,3 180 top
J8  96.5,38.5 0 top
J9  77.5,38.5 0 top
L1  11.5,37.5 270 top
L2  9.3,7.95 0 top
L3  53,29.5 180 top
L4  74,30 180 top
L5  52,10 180 top
L6  76,13.5 180 top
Q1  98,20 0 bottom
R1  20,4.95 270 top
R2  16.8,4.95 90 top
R3  25.8,8.45 270 top
R4  23.25,9.8 0 top
R5  18.3,11.95 90 top
R6  7.5,26 180 top
R7  7.5,29 0 top
R8  12.11,20.45 180 top
R9  13,23 270 top
R10  15,27 0 top
R11  11,23 270 top
R12  23.3,7.45 0 top
R13  42,32.5 90 top
R14  45.5,32.5 270 top
R15  37,29 90 top
R16  39.5,28 180 top
R17  44,25.5 270 top
R18  39.5,30 180 top
R19  63,33 90 top
R20  66,33 270 top
R21  57.5,29.5 90 top
R22  60,28 180 top
R23  66,25.55 270 top
R24  60,30.5 180 top
R25  40.5,13 90 top
R26  44,13 270 top
R27  35,9.5 90 top
R28  37.5,8.5 180 top
R29  42.5,6.5 270 top
R30  37.5,10.5 180 top
R31  64.95,16.85 90 top
R32  68,16.5 270 top
R33  59.5,12.5 90 top
R34  62,12 180 top
R35  66.5,9.5 270 top
R36  62,13.5 180 top
SPV_1  12,30.5 270 top
SPV_2  15.3,8.45 0 top
SPV_3  46,9.5 180 top
SPV_4  47,29 180 top
SPV_5  68,29.5 180 top
SPV_6  69.5,13 180 top

### Tracks (layer width: path | path; a pad name or v marks a point on that pad's centre or on a via)
ANT_DEP
  Top 1.016: J5.1 99.1,9.5 100.54,10.94 Q1.1
GND  (via drill 0.35)
  Top 0.3: C9.2 17.35,25 16,25 v15.5,24.5 | D2.A 6.85,20.65 v7.5,20 | C24.2 6.65,28.95 R7.1 6.71,30.7 v7.5,31.5 | SPV_1.2 12.32,32.33 v12,32 | C22.2 14.15,38.35 v14.5,38 | C2.2 21.38,14.37 v22.3,13.45 | C4.2 30.55,9.45 v31.5,8.5 | C3.2 8.45,11.3 v9.05,11.9 | SPV_2.2 13.47,8.78 v13.8,8.45 | C5.2 16.86,4.1 R2.1 15.51,4.16 v14.65,3.3 | D1.A 25.17,3.32 v25.8,3.95 | C25.2 43.95,13.85 R26.1 45.34,13.79 v46,14.45 | C21.2 49,14.5 v48.5,15 | C19.2 39.5,4 v39,4.5 | D5.A 36.95,15.6 v37.55,15.6 | C20.2 52.9,8.45 52.9,7.05 v52.35,6.5 | C23.2 17,21.15 v17,22 | C7.2 39.5,25 v39,25.5 | C10.2 53.85,26.85 v53.5,26.5 | SPV_4.2 48.83,28.68 v48.5,29 | C12.2 44.05,33.3 R14.1 46.7,33.3 v47,33 | C11.2 51.15,33.35 v51.5,33 | D3.A 36.65,34.15 v36.5,34 | C17.2 65.94,33.85 R20.1 67.2,33.8 v67.5,33.5 | C14.2 62.85,26.4 v62.5,26.05 | SPV_5.2 69.83,29.18 v69.5,29.5 | C15.2 74.85,27.85 v74,27 | C16.2 70.35,33.85 v70,33.5 | D4.A 59.15,34.65 v59.85,35.35 | C30.2 67.94,17.35 R32.1 69.14,17.3 v69.85,18 | D6.A 58.65,17.65 v58.5,17.5 | C29.2 71.35,17.35 v71,17 | C28.2 76.85,10.85 v76.5,10.5 | SPV_6.2 71.33,12.68 v71,13
  pour Bottom: -4,38 3,45 111.5,45 114,42.5 114,1.5 110,-2.5 -1.5,-2.5 -4,0
  pour Top: -4,38 3,45 111.5,45 114,42.5 114,1.5 110,-2.5 -1.5,-2.5 -4,0
N$1
  Top 0.3: SPV_2.3 11.47,8.12 11.3,7.95 L2.2
N$2
  Top 0.3: C3.1 12.39,9.45 SPV_2.1 SPV_2.8 18.3,9.54 R5.1
N$3
  Top 0.3: SPV_2.5 18.3,7.36 C5.1 | R2.2 16.86,5.8 C5.1 | C5.1 19.95,5.8 R1.1
N$4
  Top 0.3: SPV_2.6 19.62,8.12 20.15,7.6 C1.2 22.36,7.6 R12.1
N$5
  Top 0.3: SPV_1.3 11.68,36.48 L1.2
N$6
  Top 0.3: SPV_2.7 19.62,8.78 20.15,9.3 C1.1 21.3,9.8 R4.1
N$7  (via drill 0.35)
  Top 0.3: C4.1 27.75,9.24 R3.1 25.25,9.8 R4.2 24.34,10.1 24.34,11.71 24.05,12 v22.55,12 | SPV_2.4 14.82,7.47 v15.3,7.95
  Bottom 0.3: v15.3,7.95 19.35,12 v22.55,12
N$8
  Top 0.3: SPV_4.3 50.83,29.32 51,29.5 L3.2
N$9
  Top 0.3: C10.1 52.12,28.02 SPV_4.1 SPV_4.8 44.12,26.41 R17.1
N$10
  Top 0.3: SPV_4.5 44,30.09 C12.1 | R14.2 44.05,31.7 C12.1 | C12.1 42.05,31.65 R13.1
N$11
  Top 0.3: SPV_4.6 43.17,29.32 42.65,29.85 C6.2 40.45,29.85 R18.1
N$12
  Top 0.3: SPV_4.7 43.17,28.68 42.65,28.15 C6.1 41.85,28 R16.1
N$13  (via drill 0.35)
  Top 0.3: R16.2 38.5,28 | 38.5,28 37.2,28 R15.1 | C11.1 49.88,31.53 SPV_4.4 47.48,29.98 v46.5,29 | v41,26.5 40,26.5 38.5,28
  Bottom 0.3: v46.5,29 44,26.5 v41,26.5
N$14
  Top 0.3: SPV_5.3 71.83,29.82 72,30 L4.2
N$15
  Top 0.3: C15.1 73.12,28.52 SPV_5.1 SPV_5.8 65.12,27.23 R23.1
N$16
  Top 0.3: SPV_5.5 65.12,31.53 C17.1 | C17.1 65.94,32.15 R20.2 | C17.1 63.05,32.15 R19.1
N$17
  Top 0.3: SPV_5.6 63.67,29.82 63.15,30.35 C13.2 62.35,30.5 R24.1
N$18
  Top 0.3: SPV_5.7 63.67,29.18 63.15,28.65 C13.1 62,28.15 60.95,28.15 R22.1
N$19  (via drill 0.35)
  Top 0.3: C16.1 70.88,31.53 SPV_5.4 68.47,30.48 v68,30 | R22.2 59,28 | 59,28 58.2,28 R21.1 | v60.5,25.05 59,26.55 59,28
  Bottom 0.3: v68,30 68,29.55 63.5,25.05 v60.5,25.05
N$20
  Top 0.3: SPV_3.3 49.83,9.82 50,10 L5.2
N$21
  Top 0.3: C20.1 51.12,8.53 SPV_3.1 SPV_3.8 42.5,7.91 R29.1
N$22
  Top 0.3: SPV_3.5 42.5,11.1 C25.1 | R26.2 43.95,12.15 C25.1 | C25.1 40.55,12.15 R25.1
N$23
  Top 0.3: SPV_3.6 41.67,9.82 41.15,10.35 C18.2 40.3,10.8 38.59,10.8 R30.1
N$24
  Top 0.3: SPV_3.7 41.67,9.18 41.15,8.65 C18.1 40.25,8.15 38.65,8.15 R28.1
N$25  (via drill 0.35)
  Top 0.3: R27.1 35.2,8.5 R28.2 36.9,8.5 v39.4,6 | v46,10 46.48,10.47 SPV_3.4 49,10.6 C21.1
  Bottom 0.3: v46,10 42,6 v39.4,6
N$26
  Top 0.3: SPV_6.3 73.83,13.32 74,13.5 L6.2
N$27
  Top 0.3: C28.1 75.12,12.03 SPV_6.1 SPV_6.8 66.62,10.41 R35.1
N$28
  Top 0.3: SPV_6.5 66.5,14.1 C30.1 | C30.1 66.56,15.71 R32.2 | C30.1 65.36,15.65 R31.1
N$29
  Top 0.3: SPV_6.6 65.67,13.32 65.25,13.75 C26.2 63.05,13.75 R36.1
N$30
  Top 0.3: SPV_6.7 65.67,12.68 65.05,12.05 C26.1 62.84,12.05 R34.1
N$31
  Top 0.3: C22.1 13,33.41 SPV_1.1 SPV_1.8 13.59,27.62 R10.1
N$32
  Top 0.3: SPV_1.5 10.9,27.5 C24.1 | C24.1 8.29,27.45 R6.1 | C24.1 8.35,28.95 R7.2
N$33  (via drill 0.35)
  Top 0.3: C29.1 72.38,15.53 SPV_6.4 69.97,13.97 v69.5,13.5 | v63,10 61.8,10 61.2,10.6 R34.2 59.8,12 R33.1
  Bottom 0.3: v69.5,13.5 66,10 v63,10
N$34
  Top 0.3: SPV_1.6 11.68,26.68 11.15,26.15 C8.2 11,25.35 R11.1
N$35
  Top 0.3: SPV_1.7 12.32,26.68 12.85,26.15 C8.1 13,25.35 R9.1
N$36  (via drill 0.35)
  Top 0.3: SPV_1.4 11.03,31.48 v11.5,31 | v19,29 19,24.5 18,23.5 14.29,23.5 R9.2 13,20.54 R8.1 12.96,20.5 C23.1
  Bottom 0.3: v11.5,31 17,31 v19,29
N$44
  Bottom 1: Q1.2 97.95,13.7 97.95,21.7 93.05,26.6 93.05,35.05 J8.1
SCL
  Bottom 0.2: J9.3 80.43,36.35 55.3,36.35 | 55.3,36.35 54.43,37.22 J2.3 | 55.3,36.35 26.15,36.35 25,37.5 25,38.47 J3.3
SDA
  Bottom 0.2: J9.4 83.12,40.5 58,40.5 | 58,40.5 56.97,39.47 J2.4 | 58,40.5 28.5,40.5 27.72,39.72 J3.4
SPVIN1
  Top 0.4: L1.1 10.3,38.35 4.6,32.65 4.6,6.25 9.51,1.34 51.54,1.34 52.5,2.3 J1.1
  Top 0.508: 17.5,28 17.5,36.5 14.4,39.6 12.1,39.6 11.5,39 L1.1 | 17.5,28 C9.1 | 17.5,28 16.3,28 15.79,27.5 R10.2
SPVIN2
  Top 0.4: L2.1 8.55,7.95 14.4,2.1 48.2,2.1 50.65,4.55 54.25,4.55 55.04,3.76 J1.2
  Top 0.508: C2.1 18.3,14.2 R5.2 8.6,12.74 6.8,10.95 6.8,8.2 7.05,7.95 L2.1
SPVIN3
  Top 0.4: J1.3 53.91,6.17 53.62,6.17
  Top 0.508: C19.1 42.5,4.15 R29.2 53.16,5.71 53.62,6.17 54.5,7.05 54.5,9.5 54,10 L5.1
SPVIN4
  Top 0.4: 51,24.5 55.1,20.4 55.1,10 60.12,4.98 J1.4
  Top 0.508: C7.1 42.55,25.2 43.5,25.2 R17.2 44.2,24.5 51,24.5 53.5,24.5 55.5,26.5 55.5,28.5 54.5,29.5 L3.1
SPVIN5
  Top 0.4: 67.8,24.75 66.19,23.15 56.95,23.15 56.4,22.6 56.4,11.25 62.66,4.99 J1.5
  Top 0.508: L4.1 76.5,30 77,29.5 77,27 74.75,24.75 67.8,24.75 R23.2 65.94,24.7 C14.1
SPVIN6
  Top 0.4: 66,7.5 66,7.35 65.1,6.45 65.1,2.6 J1.6
  Top 0.508: R35.2 65.5,8.71 | 65.5,8.71 64.56,8.71 C27.1 | 65.5,8.71 65.5,8 66,7.5 75.5,7.5 78.5,10.5 78.5,13 78,13.5 L6.1
VBAT  (via drill 0.35)
  Top 0.508: R8.2 11,20.76 R11.2 10.79,22 D2.C 9.15,23.35 8.5,24 7.5,24 6.71,24.8 R6.2 | D1.C 24.09,5.97 R12.2 24.3,7.66 R3.2 | D1.C 23.57,5.45 22.8,5.45 21.5,4.16 R1.2 | R27.2 35.2,10.5 36,10.5 | 36,10.5 R30.2 | 36,10.5 D5.C | R13.2 39.45,33.3 | 39.45,33.3 D3.C 38,30 | R18.2 38,30 | 38,30 37.2,30 R15.2 | R21.2 57.7,30.5 58.5,30.5 | 58.5,30.5 R24.2 | 58.5,30.5 58,31 D4.C 58,33 58.8,33.8 R19.2 | R33.2 59.7,13.5 60.5,13.5 | 60.5,13.5 R36.2 | 60.5,13.5 60,14 D6.C 61.5,16.85 | R31.2 64.85,17.75 62.4,17.75 61.5,16.85 | 61.5,16.85 61.5,20 59.5,22 v58.5,22 | D1.C 24.57,6.45 31.8,6.45 33,7.65 v33,10 | R25.2 40.05,14.24 38.55,14.24 38.08,13.78 | 39.45,33.3 39.5,33.35 39.5,35.15 39.85,35.5 53.95,35.5 55,34.45 v55,34
  Top 1.016: v15.1,17.45 12.15,17.45 9.15,20.45 D2.C | v39.5,19 39.5,15.2 38.08,13.78 36.65,12.35 D5.C | J2.6 62.05,37.2 61.5,36.65 57.1,36.65 55,34.55 v55,34 55,33.45 56.15,32.3 57.95,32.3 D4.C
  Bottom 1: v58.49,21.99 v58.5,22
  Bottom 1.016: BT1.PWR@1 39.5,21.99 | 39.5,21.99 55,21.99 | 55,21.99 v58.49,21.99 | 55,21.99 v55,34 | v39.5,19 39.5,21.99 | BT1.PWR@1 25.02,21.99 20.48,17.45 v15.1,17.45 | v33,10 25.87,17.13 BT1.PWR@1 | v58.5,22 81.55,22 90.1,30.55 90.1,39 91.45,40.35 98.05,40.35 99.04,39.36 J8.2
VCC
  Top 0.4: J9.1 75.34,40.66 50.45,40.66 50.4,40.61 | 50.4,40.61 49.35,39.56 J2.1 | 50.4,40.61 21.99,40.61 20.1,38.71 J3.1
VOUT
  Top 0.508: J2.5 61.01,39.85 70.9,39.85 77.95,32.8 89.15,32.8 91.6,30.35 91.6,7 93.3,5.3 97.2,5.3 99,3.5 J6.1